# EAGLE schematic lpc1788_board (EAGLE 6.4)

## Sheet 1 of 4: LPC1788
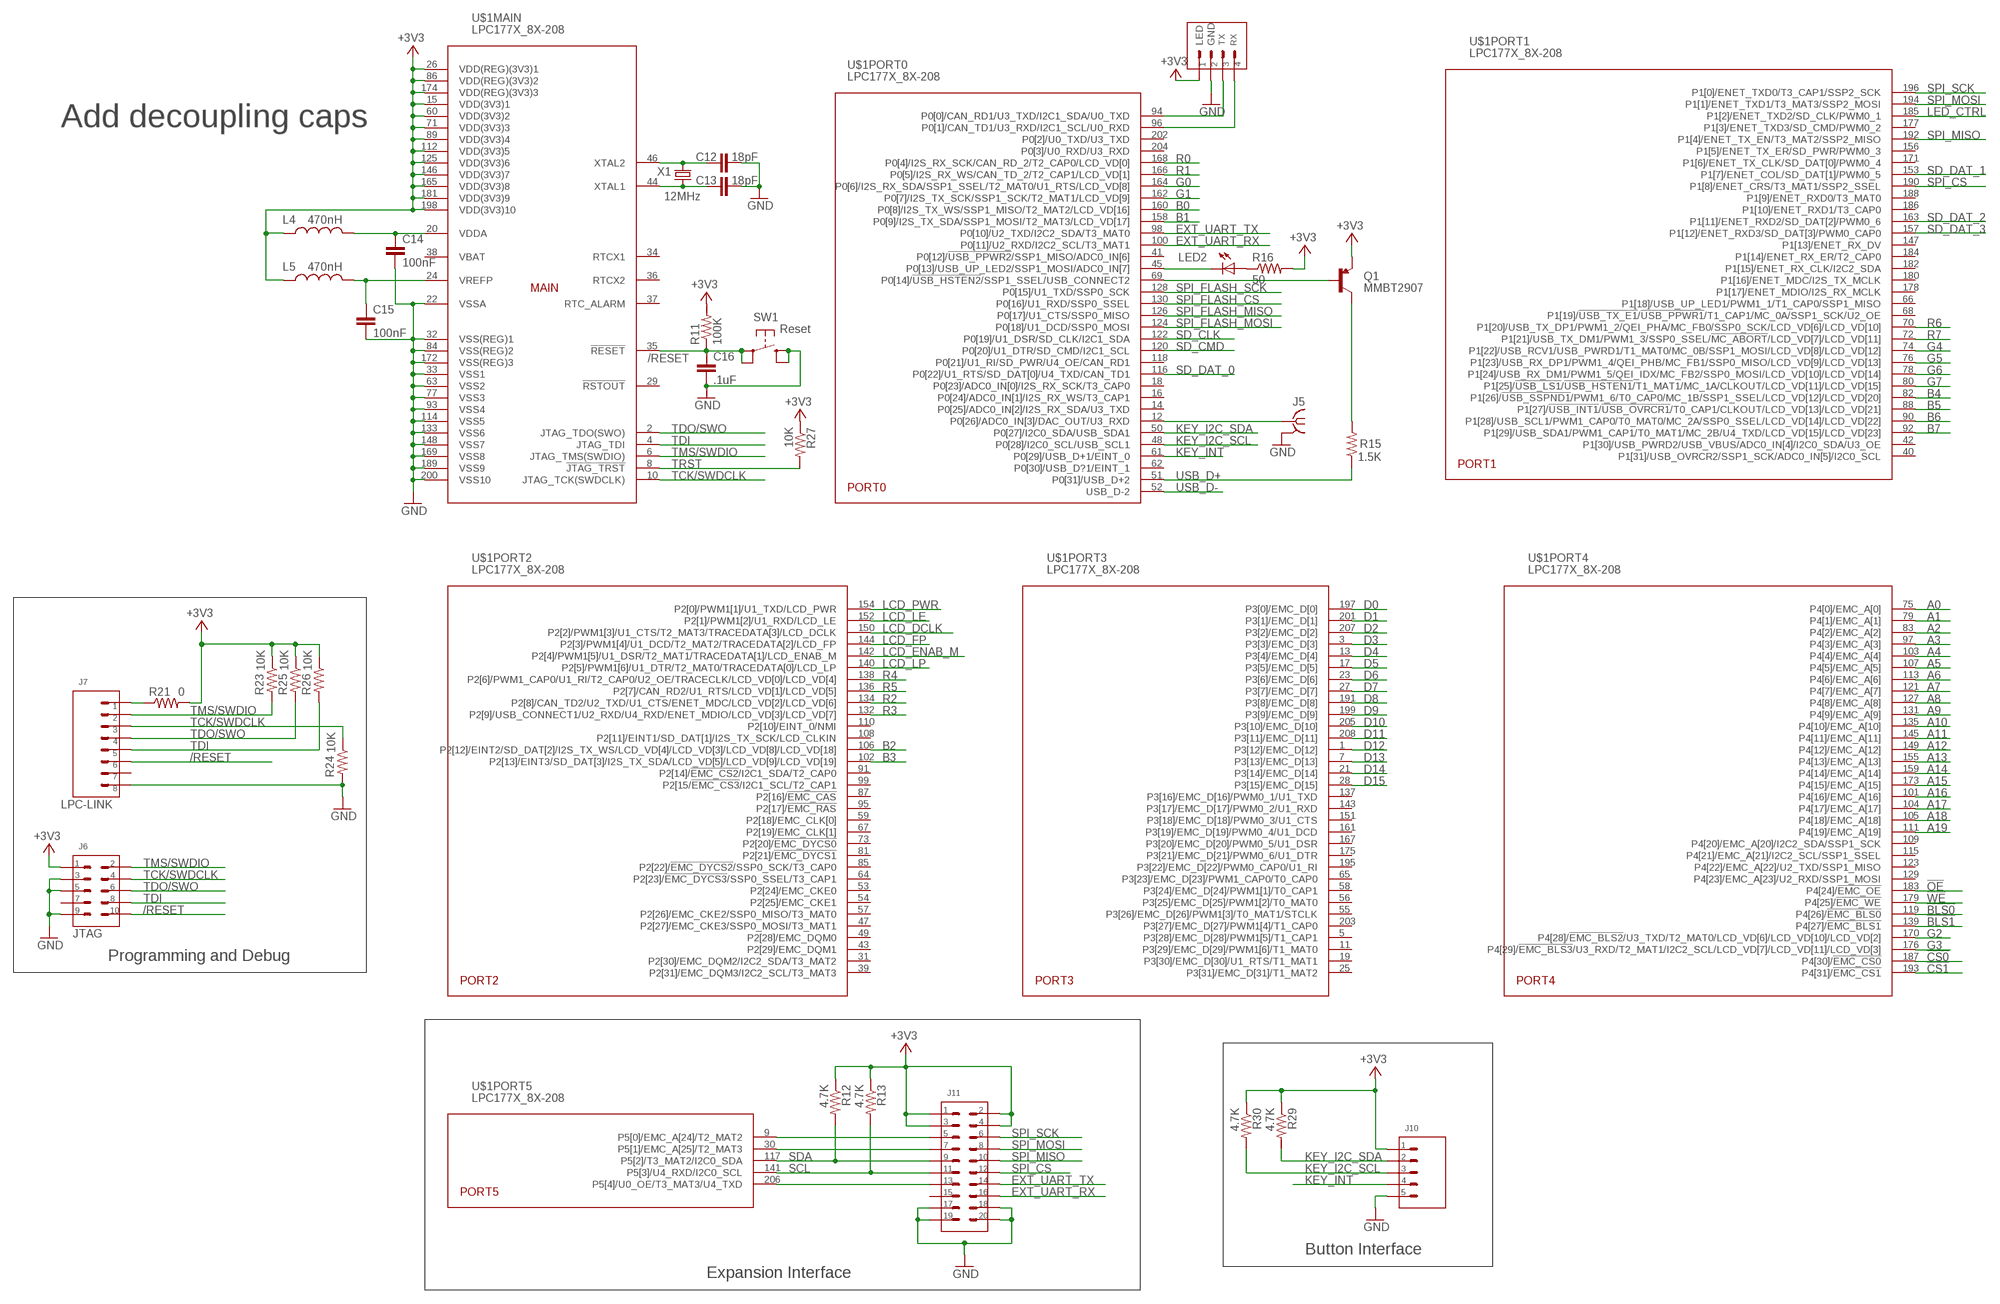
[diagram p0: schematic, sheet 1]

### Parts
C12  18pF  C-EUC0603  [C0603]
C13  18pF  C-EUC0603  [C0603]
C14  100nF  C-EUC0402  [C0402]
C15  100nF  C-EUC0402  [C0402]
C16  .1uF  C-EUC0603  [C0603]
J4  Console  FLEX_SERIAL_HEADER  [4-PIN_1.25MM]
J5  SMA-J-P-X-ST-EM1  [SMA-J-P-X-ST-EM1]
J6  JTAG  10PIN_5X2_.050IN  [10-PIN_5X2_.050IN_SMT]
J7  JTAG  8PIN_SIP_.100IN  [8-PIN_SIP_.100IN]
J10  MOLEX_527930570_5PIN_FFC_CONNECTOR  [MOLEX_527930570]
J11  20PIN_10X2_.100IN  [20-PIN_10X2_.100IN]
L4  470nH  INDUCTOR_0603  [0603]
L5  470nH  INDUCTOR_0603  [0603]
LED2  CHG  LEDCHIPLED_0603  [CHIPLED_0603]
Q1  MMBT2907  TRANSISTOR_PNPMMBT4403  [SOT23]
R11  100K  R-US_R0603  [R0603]
R12  4.7K  R-US_R0603  [R0603]
R13  4.7K  R-US_R0603  [R0603]
R15  1.5K  R-US_R0603  [R0603]
R16  50  R-US_R0402  [R0402]
R21  0  R-US_R0603  [R0603]
R23  10K  R-US_R0603  [R0603]
R24  10K  R-US_R0603  [R0603]
R25  10K  R-US_R0603  [R0603]
R26  10K  R-US_R0603  [R0603]
R27  10K  R-US_R0603  [R0603]
R29  4.7K  R-US_R0603  [R0603]
R30  4.7K  R-US_R0603  [R0603]
SW1  Reset  SMT_PUSHBUTTON  [SMT_PUSHBUTTON]
U$1  LPC177X_8X-208  [LQFP208]
X1  12MHz  XTAL_2SMD_8MMX4.5MM12MHZ  [2-SMD_8MMX4.5MM]

### Nets
!BLS0: U$1.119(PORT4:P4[26]/!EMC_BLS0!) ; also sheet 4
!BLS1: U$1.139(PORT4:P4[27]/!EMC_BLS1!) ; also sheet 4
!CS0: U$1.187(PORT4:P4[30]/!EMC_CS0!) ; also sheet 4
!CS1: U$1.193(PORT4:P4[31]/!EMC_CS1!)
!OE: U$1.183(PORT4:P4[24]/!EMC_OE!) ; also sheet 4
!WE: U$1.179(PORT4:P4[25]/!EMC_WE!) ; also sheet 4
+3V3: J4.1(S1) J6.P$1(S1) J10.P$1(S1) J11.1(S1) J11.2(S2) J11.3(S3) J11.4(S4) L4.1 L5.1 Q1.2(E) R11.2 R12.1 R13.1 R16.2 R21.2 R23.1 R25.1 R26.1 R27.1 R29.1 R30.1 U$1.15(MAIN:VDD(3V3)1) U$1.26(MAIN:VDD(REG)(3V3)1) U$1.60(MAIN:VDD(3V3)2) U$1.71(MAIN:VDD(3V3)3) U$1.86(MAIN:VDD(REG)(3V3)2) U$1.89(MAIN:VDD(3V3)4) U$1.112(MAIN:VDD(3V3)5) U$1.125(MAIN:VDD(3V3)6) U$1.146(MAIN:VDD(3V3)7) U$1.165(MAIN:VDD(3V3)8) U$1.174(MAIN:VDD(REG)(3V3)3) U$1.181(MAIN:VDD(3V3)9) U$1.198(MAIN:VDD(3V3)10) ; also sheet 2,3,4
/RESET: C16.1 J6.P$10(S10) J7.6(S6) R11.1 SW1.P$1(P1) SW1.P$2(P) U$1.35(MAIN:!RESET!)
A0: U$1.75(PORT4:P4[0]/EMC_A[0]) ; also sheet 4
A1: U$1.79(PORT4:P4[1]/EMC_A[1]) ; also sheet 4
A2: U$1.83(PORT4:P4[2]/EMC_A[2]) ; also sheet 4
A3: U$1.97(PORT4:P4[3]/EMC_A[3]) ; also sheet 4
A4: U$1.103(PORT4:P4[4]/EMC_A[4]) ; also sheet 4
A5: U$1.107(PORT4:P4[5]/EMC_A[5]) ; also sheet 4
A6: U$1.113(PORT4:P4[6]/EMC_A[6]) ; also sheet 4
A7: U$1.121(PORT4:P4[7]/EMC_A[7]) ; also sheet 4
A8: U$1.127(PORT4:P4[8]/EMC_A[8]) ; also sheet 4
A9: U$1.131(PORT4:P4[9]/EMC_A[9]) ; also sheet 4
A10: U$1.135(PORT4:P4[10]/EMC_A[10]) ; also sheet 4
A11: U$1.145(PORT4:P4[11]/EMC_A[11]) ; also sheet 4
A12: U$1.149(PORT4:P4[12]/EMC_A[12]) ; also sheet 4
A13: U$1.155(PORT4:P4[13]/EMC_A[13]) ; also sheet 4
A14: U$1.159(PORT4:P4[14]/EMC_A[14]) ; also sheet 4
A15: U$1.173(PORT4:P4[15]/EMC_A[15]) ; also sheet 4
A16: U$1.101(PORT4:P4[16]/EMC_A[16]) ; also sheet 4
A17: U$1.104(PORT4:P4[17]/EMC_A[17]) ; also sheet 4
A18: U$1.105(PORT4:P4[18]/EMC_A[18]) ; also sheet 4
A19: U$1.111(PORT4:P4[19]/EMC_A[19]) ; also sheet 4
B0: U$1.160(PORT0:P0[8]/I2S_TX_WS/SSP1_MISO/T2_MAT2/LCD_VD[16]) ; also sheet 3
B1: U$1.158(PORT0:P0[9]/I2S_TX_SDA/SSP1_MOSI/T2_MAT3/LCD_VD[17]) ; also sheet 3
B2: U$1.106(PORT2:P2[12]/EINT2/SD_DAT[2]/I2S_TX_WS/LCD_VD[4]/LCD_VD[3]/LCD_VD[8]/LCD_VD[18]) ; also sheet 3
B3: U$1.102(PORT2:P2[13]/EINT3/SD_DAT[3]/I2S_TX_SDA/LCD_VD[5]/LCD_VD[9]/LCD_VD[19]) ; also sheet 3
B4: U$1.82(PORT1:P1[26]/!USB_SSPND1!/PWM1_6/T0_CAP0/MC_1B/SSP1_SSEL/LCD_VD[12]/LCD_VD[20]) ; also sheet 3
B5: U$1.88(PORT1:P1[27]/!USB_INT1!/!USB_OVRCR1!/T0_CAP1/CLKOUT/LCD_VD[13]/LCD_VD[21]) ; also sheet 3
B6: U$1.90(PORT1:P1[28]/USB_SCL1/PWM1_CAP0/T0_MAT0/MC_2A/SSP0_SSEL/LCD_VD[14]/LCD_VD[22]) ; also sheet 3
B7: U$1.92(PORT1:P1[29]/USB_SDA1/PWM1_CAP1/T0_MAT1/MC_2B/U4_TXD/LCD_VD[15]/LCD_VD[23]) ; also sheet 3
D0: U$1.197(PORT3:P3[0]/EMC_D[0]) ; also sheet 4
D1: U$1.201(PORT3:P3[1]/EMC_D[1]) ; also sheet 4
D2: U$1.207(PORT3:P3[2]/EMC_D[2]) ; also sheet 4
D3: U$1.3(PORT3:P3[3]/EMC_D[3]) ; also sheet 4
D4: U$1.13(PORT3:P3[4]/EMC_D[4]) ; also sheet 4
D5: U$1.17(PORT3:P3[5]/EMC_D[5]) ; also sheet 4
D6: U$1.23(PORT3:P3[6]/EMC_D[6]) ; also sheet 4
D7: U$1.27(PORT3:P3[7]/EMC_D[7]) ; also sheet 4
D8: U$1.191(PORT3:P3[8]/EMC_D[8]) ; also sheet 4
D9: U$1.199(PORT3:P3[9]/EMC_D[9]) ; also sheet 4
D10: U$1.205(PORT3:P3[10]/EMC_D[10]) ; also sheet 4
D11: U$1.208(PORT3:P3[11]/EMC_D[11]) ; also sheet 4
D12: U$1.1(PORT3:P3[12]/EMC_D[12]) ; also sheet 4
D13: U$1.7(PORT3:P3[13]/EMC_D[13]) ; also sheet 4
D14: U$1.21(PORT3:P3[14]/EMC_D[14]) ; also sheet 4
D15: U$1.28(PORT3:P3[15]/EMC_D[15]) ; also sheet 4
EXT_UART_RX: J11.16(S16) U$1.100(PORT0:P0[11]/U2_RXD/I2C2_SCL/T3_MAT1)
EXT_UART_TX: J11.14(S14) U$1.98(PORT0:P0[10]/U2_TXD/I2C2_SDA/T3_MAT0)
G0: U$1.164(PORT0:P0[6]/I2S_RX_SDA/SSP1_SSEL/T2_MAT0/U1_RTS/LCD_VD[8]) ; also sheet 3
G1: U$1.162(PORT0:P0[7]/I2S_TX_SCK/SSP1_SCK/T2_MAT1/LCD_VD[9]) ; also sheet 3
G2: U$1.170(PORT4:P4[28]/!EMC_BLS2!/U3_TXD/T2_MAT0/LCD_VD[6]/LCD_VD[10]/LCD_VD[2]) ; also sheet 3
G3: U$1.176(PORT4:P4[29]/!EMC_BLS3!/U3_RXD/T2_MAT1/I2C2_SCL/LCD_VD[7]/LCD_VD[11]/LCD_VD[3]) ; also sheet 3
G4: U$1.74(PORT1:P1[22]/USB_RCV1/USB_PWRD1/T1_MAT0/MC_0B/SSP1_MOSI/LCD_VD[8]/LCD_VD[12]) ; also sheet 3
G5: U$1.76(PORT1:P1[23]/USB_RX_DP1/PWM1_4/QEI_PHB/MC_FB1/SSP0_MISO/LCD_VD[9]/LCD_VD[13]) ; also sheet 3
G6: U$1.78(PORT1:P1[24]/USB_RX_DM1/PWM1_5/QEI_IDX/MC_FB2/SSP0_MOSI/LCD_VD[10]/LCD_VD[14]) ; also sheet 3
G7: U$1.80(PORT1:P1[25]/!USB_LS1!/!USB_HSTEN1!/T1_MAT1/MC_1A/CLKOUT/LCD_VD[11]/LCD_VD[15]) ; also sheet 3
GND: C12.2 C13.2 C14.2 C15.2 C16.2 J4.2(S2) J5.G@1(GND) J6.P$3(S3) J6.P$5(S5) J6.P$9(S9) J7.8(S8) J10.P$5(S5) J11.17(S17) J11.18(S18) J11.19(S19) J11.20(S20) R24.2 SW1.P$3(S1) SW1.P$4(S) U$1.22(MAIN:VSSA) U$1.32(MAIN:VSS(REG)1) U$1.33(MAIN:VSS1) U$1.63(MAIN:VSS2) U$1.77(MAIN:VSS3) U$1.84(MAIN:VSS(REG)2) U$1.93(MAIN:VSS4) U$1.114(MAIN:VSS5) U$1.133(MAIN:VSS6) U$1.148(MAIN:VSS7) U$1.169(MAIN:VSS8) U$1.172(MAIN:VSS(REG)3) U$1.189(MAIN:VSS9) U$1.200(MAIN:VSS10) ; also sheet 2,3,4
KEY_I2C_SCL: J10.P$3(S3) R30.2 U$1.48(PORT0:P0[28]/I2C0_SCL/USB_SCL1)
KEY_I2C_SDA: J10.P$2(S2) R29.2 U$1.50(PORT0:P0[27]/I2C0_SDA/USB_SDA1)
KEY_INT: J10.P$4(S4) U$1.61(PORT0:P0[29]/USB_D+1/EINT_0)
LCD_DCLK: U$1.150(PORT2:P2[2]/PWM1[3]/U1_CTS/T2_MAT3/TRACEDATA[3]/LCD_DCLK) ; also sheet 3
LCD_ENAB_M: U$1.142(PORT2:P2[4]/PWM1[5]/U1_DSR/T2_MAT1/TRACEDATA[1]/LCD_ENAB_M) ; also sheet 3
LCD_FP: U$1.144(PORT2:P2[3]/PWM1[4]/U1_DCD/T2_MAT2/TRACEDATA[2]/LCD_FP) ; also sheet 3
LCD_LE: U$1.152(PORT2:P2[1]/PWM1[2]/U1_RXD/LCD_LE) ; also sheet 3
LCD_LP: U$1.140(PORT2:P2[5]/PWM1[6]/U1_DTR/T2_MAT0/TRACEDATA[0]/LCD_LP) ; also sheet 3
LCD_PWR: U$1.154(PORT2:P2[0]/PWM1[1]/U1_TXD/LCD_PWR) ; also sheet 3
LED_CTRL: U$1.185(PORT1:P1[2]/ENET_TXD2/SD_CLK/PWM0_1) ; also sheet 2
N$15: C12.1 U$1.46(MAIN:XTAL2) X1.2
N$16: C13.1 U$1.44(MAIN:XTAL1) X1.1
N$17: C14.1 L4.2 U$1.20(MAIN:VDDA)
N$18: C15.1 L5.2 U$1.24(MAIN:VREFP)
N$21: Q1.3(C) R15.2
N$22: Q1.1(B) U$1.69(PORT0:P0[14]/!USB_HSTEN2!/SSP1_SSEL/USB_CONNECT2)
N$23: LED2.A R16.1
N$24: LED2.C U$1.45(PORT0:P0[13]/USB_UP_LED2/SSP1_MOSI/ADC0_IN[7])
N$25: J4.3(S3) U$1.94(PORT0:P0[0]/CAN_RD1/U3_TXD/I2C1_SDA/U0_TXD)
N$26: J4.4(S4) U$1.96(PORT0:P0[1]/CAN_TD1/U3_RXD/I2C1_SCL/U0_RXD)
N$27: J5.1 U$1.12(PORT0:P0[26]/ADC0_IN[3]/DAC_OUT/U3_RXD)
N$30: J11.13(S13) U$1.206(PORT5:P5[4]/U0_OE/T3_MAT3/U4_TXD)
N$32: J11.7(S7) U$1.30(PORT5:P5[1]/EMC_A[25]/T2_MAT3)
N$34: J11.5(S5) U$1.9(PORT5:P5[0]/EMC_A[24]/T2_MAT2)
N$36: J7.1(S1) R21.1
R0: U$1.168(PORT0:P0[4]/I2S_RX_SCK/CAN_RD_2/T2_CAP0/LCD_VD[0]) ; also sheet 3
R1: U$1.166(PORT0:P0[5]/I2S_RX_WS/CAN_TD_2/T2_CAP1/LCD_VD[1]) ; also sheet 3
R2: U$1.134(PORT2:P2[8]/CAN_TD2/U2_TXD/U1_CTS/ENET_MDC/LCD_VD[2]/LCD_VD[6]) ; also sheet 3
R3: U$1.132(PORT2:P2[9]/USB_CONNECT1/U2_RXD/U4_RXD/ENET_MDIO/LCD_VD[3]/LCD_VD[7]) ; also sheet 3
R4: U$1.138(PORT2:P2[6]/PWM1_CAP0/U1_RI/T2_CAP0/U2_OE/TRACECLK/LCD_VD[0]/LCD_VD[4]) ; also sheet 3
R5: U$1.136(PORT2:P2[7]/CAN_RD2/U1_RTS/LCD_VD[1]/LCD_VD[5]) ; also sheet 3
R6: U$1.70(PORT1:P1[20]/USB_TX_DP1/PWM1_2/QEI_PHA/MC_FB0/SSP0_SCK/LCD_VD[6]/LCD_VD[10]) ; also sheet 3
R7: U$1.72(PORT1:P1[21]/USB_TX_DM1/PWM1_3/SSP0_SSEL/!MC_ABORT!/LCD_VD[7]/LCD_VD[11]) ; also sheet 3
SCL: J11.11(S11) R13.2 U$1.141(PORT5:P5[3]/U4_RXD/I2C0_SCL)
SD_CLK: U$1.122(PORT0:P0[19]/U1_DSR/SD_CLK/I2C1_SDA) ; also sheet 4
SD_CMD: U$1.120(PORT0:P0[20]/U1_DTR/SD_CMD/I2C1_SCL) ; also sheet 4
SD_DAT_0: U$1.116(PORT0:P0[22]/U1_RTS/SD_DAT[0]/U4_TXD/CAN_TD1) ; also sheet 4
SD_DAT_1: U$1.153(PORT1:P1[7]/ENET_COL/SD_DAT[1]/PWM0_5) ; also sheet 4
SD_DAT_2: U$1.163(PORT1:P1[11]/ENET_RXD2/SD_DAT[2]/PWM0_6) ; also sheet 4
SD_DAT_3: U$1.157(PORT1:P1[12]/ENET_RXD3/SD_DAT[3]/PWM0_CAP0) ; also sheet 4
SDA: J11.9(S9) R12.2 U$1.117(PORT5:P5[2]/T3_MAT2/I2C0_SDA)
SPI_CS: J11.12(S12) U$1.190(PORT1:P1[8]/ENET_CRS/T3_MAT1/SSP2_SSEL)
SPI_FLASH_CS: U$1.130(PORT0:P0[16]/U1_RXD/SSP0_SSEL) ; also sheet 4
SPI_FLASH_MISO: U$1.126(PORT0:P0[17]/U1_CTS/SSP0_MISO) ; also sheet 4
SPI_FLASH_MOSI: U$1.124(PORT0:P0[18]/U1_DCD/SSP0_MOSI) ; also sheet 4
SPI_FLASH_SCK: U$1.128(PORT0:P0[15]/U1_TXD/SSP0_SCK) ; also sheet 4
SPI_MISO: J11.10(S10) U$1.192(PORT1:P1[4]/ENET_TX_EN/T3_MAT2/SSP2_MISO)
SPI_MOSI: J11.8(S8) U$1.194(PORT1:P1[1]/ENET_TXD1/T3_MAT3/SSP2_MOSI)
SPI_SCK: J11.6(S6) U$1.196(PORT1:P1[0]/ENET_TXD0/T3_CAP1/SSP2_SCK)
TCK/SWDCLK: J6.P$4(S4) J7.3(S3) R24.1 U$1.10(MAIN:JTAG_TCK(SWDCLK))
TDI: J6.P$8(S8) J7.5(S5) R26.2 U$1.4(MAIN:JTAG_TDI)
TDO/SWO: J6.P$6(S6) J7.4(S4) R25.2 U$1.2(MAIN:JTAG_TDO(SWO))
TMS/SWDIO: J6.P$2(S2) J7.2(S2) R23.2 U$1.6(MAIN:JTAG_TMS(SWDIO))
TRST: R27.2 U$1.8(MAIN:!JTAG_TRST!)
USB_D+: R15.1 U$1.51(PORT0:P0[31]/USB_D+2) ; also sheet 2
USB_D-: U$1.52(PORT0:USB_D-2) ; also sheet 2
Unconnected: J6.P$7(S7) J7.7(S7) J11.15(S15) U$1.5(PORT3:P3[28]/EMC_D[28]/PWM1[5]/T1_CAP1) U$1.11(PORT3:P3[29]/EMC_D[29]/PWM1[6]/T1_MAT0) U$1.14(PORT0:P0[25]/ADC0_IN[2]/I2S_RX_SDA/U3_TXD) U$1.16(PORT0:P0[24]/ADC0_IN[1]/I2S_RX_WS/T3_CAP1) U$1.18(PORT0:P0[23]/ADC0_IN[0]/I2S_RX_SCK/T3_CAP0) U$1.19(PORT3:P3[30]/EMC_D[30]/U1_RTS/T1_MAT1) U$1.25(PORT3:P3[31]/EMC_D[31]/T1_MAT2) U$1.29(MAIN:!RSTOUT!) U$1.31(PORT2:P2[30]/EMC_DQM2/I2C2_SDA/T3_MAT2) U$1.34(MAIN:RTCX1) U$1.36(MAIN:RTCX2) U$1.37(MAIN:RTC_ALARM) U$1.38(MAIN:VBAT) U$1.39(PORT2:P2[31]/EMC_DQM3/I2C2_SCL/T3_MAT3) U$1.40(PORT1:P1[31]/USB_OVRCR2/SSP1_SCK/ADC0_IN[5]/I2C0_SCL) U$1.41(PORT0:P0[12]/!USB_PPWR2!/SSP1_MISO/ADC0_IN[6]) U$1.42(PORT1:P1[30]/USB_PWRD2/USB_VBUS/ADC0_IN[4]/I2C0_SDA/U3_OE) U$1.43(PORT2:P2[29]/EMC_DQM1) U$1.47(PORT2:P2[27]/EMC_CKE3/SSP0_MOSI/T3_MAT1) U$1.49(PORT2:P2[28]/EMC_DQM0) U$1.53(PORT2:P2[24]/EMC_CKE0) U$1.54(PORT2:P2[25]/EMC_CKE1) U$1.55(PORT3:P3[26]/EMC_D[26]/PWM1[3]/T0_MAT1/STCLK) U$1.56(PORT3:P3[25]/EMC_D[25]/PWM1[2]/T0_MAT0) U$1.57(PORT2:P2[26]/EMC_CKE2/SSP0_MISO/T3_MAT0) U$1.58(PORT3:P3[24]/EMC_D[24]/PWM1[1]/T0_CAP1) U$1.59(PORT2:P2[18]/EMC_CLK[0]) U$1.62(PORT0:P0[30]/USB_D?1/EINT_1) U$1.64(PORT2:P2[23]/!EMC_DYCS3!/SSP0_SSEL/T3_CAP1) U$1.65(PORT3:P3[23]/EMC_D[23]/PWM1_CAP0/T0_CAP0) U$1.66(PORT1:P1[18]/USB_UP_LED1/PWM1_1/T1_CAP0/SSP1_MISO) U$1.67(PORT2:P2[19]/EMC_CLK[1]) U$1.68(PORT1:P1[19]/!USB_TX_E1!/!USB_PPWR1!/T1_CAP1/MC_0A/SSP1_SCK/U2_OE) U$1.73(PORT2:P2[20]/!EMC_DYCS0!) U$1.81(PORT2:P2[21]/!EMC_DYCS1!) U$1.85(PORT2:P2[22]/!EMC_DYCS2!/SSP0_SCK/T3_CAP0) U$1.87(PORT2:P2[16]/!EMC_CAS!) U$1.91(PORT2:P2[14]/!EMC_CS2!/I2C1_SDA/T2_CAP0) U$1.95(PORT2:P2[17]/!EMC_RAS!) U$1.99(PORT2:P2[15/!EMC_CS3!/I2C1_SCL/T2_CAP1) U$1.108(PORT2:P2[11]/EINT1/SD_DAT[1]/I2S_TX_SCK/LCD_CLKIN) U$1.109(PORT4:P4[20]/EMC_A[20]/I2C2_SDA/SSP1_SCK) U$1.110(PORT2:P2[10]/EINT_0/NMI) U$1.115(PORT4:P4[21]/EMC_A[21]/I2C2_SCL/SSP1_SSEL) U$1.118(PORT0:P0[21]/U1_RI/SD_PWR/U4_OE/CAN_RD1) U$1.123(PORT4:P4[22]/EMC_A[22]/U2_TXD/SSP1_MISO) U$1.129(PORT4:P4[23]/EMC_A[23]/U2_RXD/SSP1_MOSI) U$1.137(PORT3:P3[16]/EMC_D[16]/PWM0_1/U1_TXD) U$1.143(PORT3:P3[17]/EMC_D[17]/PWM0_2/U1_RXD) U$1.147(PORT1:P1[13]/ENET_RX_DV) U$1.151(PORT3:P3[18]/EMC_D[18]/PWM0_3/U1_CTS) U$1.156(PORT1:P1[5]/ENET_TX_ER/SD_PWR/PWM0_3) U$1.161(PORT3:P3[19]/EMC_D[19]/PWM0_4/U1_DCD) U$1.167(PORT3:P3[20]/EMC_D[20]/PWM0_5/U1_DSR) U$1.171(PORT1:P1[6]/ENET_TX_CLK/SD_DAT[0]/PWM0_4) U$1.175(PORT3:P3[21]/EMC_D[21]/PWM0_6/U1_DTR) U$1.177(PORT1:P1[3]/ENET_TXD3/SD_CMD/PWM0_2) U$1.178(PORT1:P1[17]/ENET_MDIO/I2S_RX_MCLK) U$1.180(PORT1:P1[16]/ENET_MDC/I2S_TX_MCLK) U$1.182(PORT1:P1[15]/ENET_RX_CLK/I2C2_SDA) U$1.184(PORT1:P1[14]/ENET_RX_ER/T2_CAP0) U$1.186(PORT1:P1[10]/ENET_RXD1/T3_CAP0) U$1.188(PORT1:P1[9]/ENET_RXD0/T3_MAT0) U$1.195(PORT3:P3[22]/EMC_D[22]/PWM0_CAP0/U1_RI) U$1.202(PORT0:P0[2]/U0_TXD/U3_TXD) U$1.203(PORT3:P3[27]/EMC_D[27]/PWM1[4]/T1_CAP0) U$1.204(PORT0:P0[3]/U0_RXD/U3_RXD)

### Notes on the sheet
- Add decoupling caps
- LPC-LINK
- JTAG
- Programming and Debug
- Button Interface
- Expansion Interface

## Sheet 2 of 4: Power
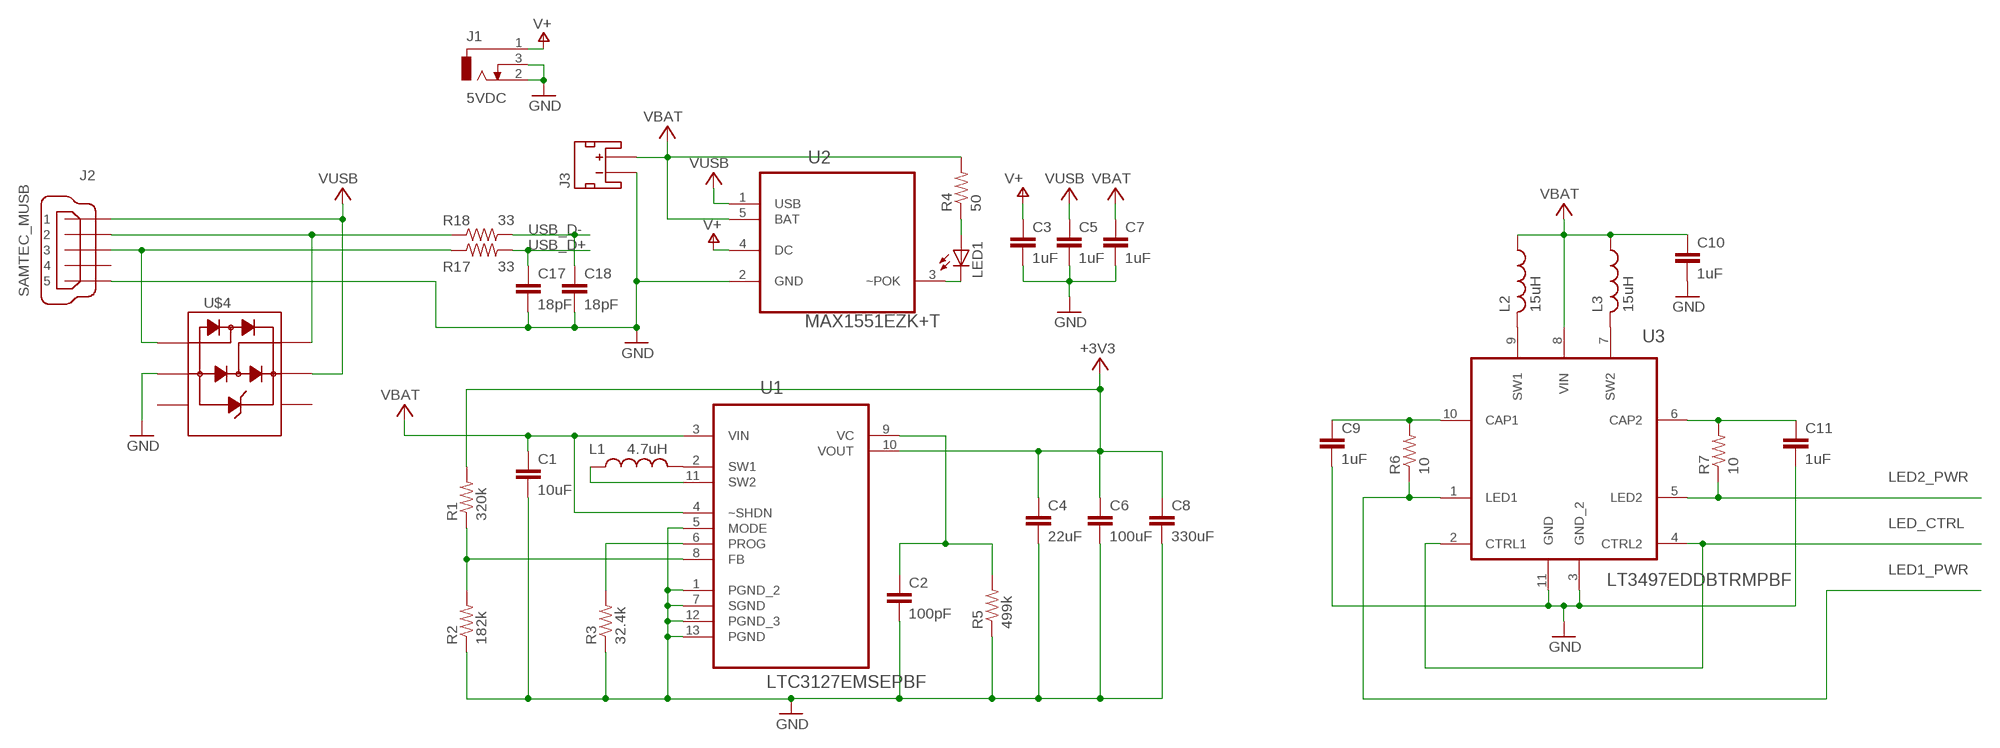
[diagram p1: schematic, sheet 2]

### Parts
C1  10uF  C-EUC0402  [C0402]
C2  100pF  C-EUC0402  [C0402]
C3  1uF  C-EUC0402  [C0402]
C4  22uF  C-EUC0805  [C0805]
C5  1uF  C-EUC0402  [C0402]
C6  100uF  C-EUC1206  [C1206]
C7  1uF  C-EUC0402  [C0402]
C8  330uF  C-EUC1206  [C1206]
C9  1uF  C-EUC0805  [C0805]
C10  1uF  C-EUC0402  [C0402]
C11  1uF  C-EUC0805  [C0805]
C17  18pF  C-EUC0402  [C0402]
C18  18pF  C-EUC0402  [C0402]
J1  5VDC  DC_POWER_JACK_PJ-045  [PJ-045]
J2  SAMTEC_MUSB  [MUSB-05-X-B-SM-A]
J3  JST_2MM_SMT  [JST_2MM_SMT]
L1  4.7uH  INDUCTOR_NR6028  [NR6028]
L2  15uH  L-USL3225M  [L3225M]
L3  15uH  L-USL3225M  [L3225M]
LED1  CHG  LEDCHIPLED_0603  [CHIPLED_0603]
R1  320k  R-US_R0402  [R0402]
R2  182k  R-US_R0402  [R0402]
R3  32.4k  R-US_R0402  [R0402]
R4  50  R-US_R0402  [R0402]
R5  499k  R-US_R0402  [R0402]
R6  10  R-US_R0402  [R0402]
R7  10  R-US_R0402  [R0402]
R17  33  R-US_R0402  [R0402]
R18  33  R-US_R0402  [R0402]
U1  LTC3127EMSEPBF  [SOP65P490X110-13N]
U2  MAX1551EZK+T  [SOT95P275X110-5N]
U3  LT3497EDDBTRMPBF  [DFN300X200X80-11N]
U$4  NUP2202  [SC-88]

### Nets
+3V3: C4.1 C6.1 C8.1 R1.2 U1.10(VOUT) ; also sheet 1,3,4
+VBAT: C1.1 C7.1 C10.1 J3.2(+) L2.1 L3.1 R4.2 U1.3(VIN) U1.4(~SHDN) U2.5(BAT) U3.8(VIN) ; supply symbol labelled VBAT
+VUSB: C5.1 J2.1 U2.1(USB) U$4.P$5 ; supply symbol labelled VUSB
GND: C1.2 C2.2 C3.2 C4.2 C5.2 C6.2 C7.2 C8.2 C9.2 C10.2 C11.2 C17.2 C18.2 J1.2 J1.3 J2.5 J3.1(-) R2.1 R3.1 R5.1 U1.1(PGND_2) U1.5(MODE) U1.7(SGND) U1.12(PGND_3) U1.13(PGND) U2.2(GND) U3.3(GND_2) U3.11(GND) U$4.P$2 ; also sheet 1,3,4
LED1_PWR: R6.1 U3.1(LED1) ; also sheet 3
LED2_PWR: R7.1 U3.5(LED2) ; also sheet 3
LED_CTRL: U3.2(CTRL1) U3.4(CTRL2) ; also sheet 1
N$1: R3.2 U1.6(PROG)
N$2: R1.1 R2.2 U1.8(FB)
N$3: L1.2 U1.2(SW1)
N$4: L1.1 U1.11(SW2)
N$5: LED1.C U2.3(~POK)
N$6: C9.1 R6.2 U3.10(CAP1)
N$7: C2.1 R5.2 U1.9(VC)
N$8: LED1.A R4.1
N$11: C11.1 R7.2 U3.6(CAP2)
N$12: L2.2 U3.9(SW1)
N$13: L3.2 U3.7(SW2)
N$19: J2.2 R18.1 U$4.P$6
N$20: J2.3 R17.1 U$4.P$1
USB_D+: C17.1 R17.2 ; also sheet 1
USB_D-: C18.1 R18.2 ; also sheet 1
V+: C3.1 J1.1 U2.4(DC)
Unconnected: J2.4 U$4.P$3 U$4.P$4

## Sheet 3 of 4: LCD
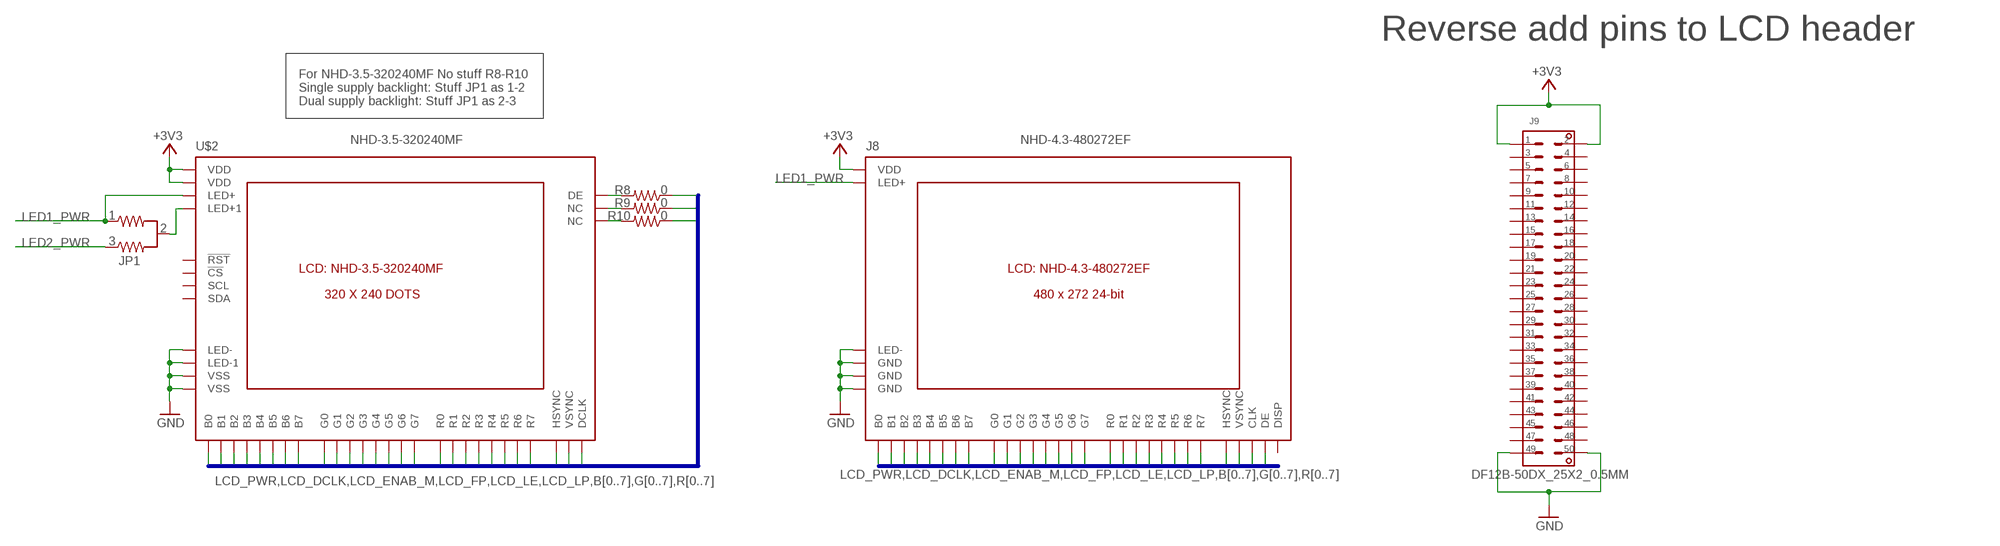
[diagram p2: schematic, sheet 3]

### Parts
J8  NHD-4.3-480272EF  [FCI_62684-402100ALF]
J9  DF12B-50DX_25X2_0.5MM  [DF12B-50DX_25X2_0.5MM]
JP1  RESISTOR_JUMPER_0402  [RESISTOR_JUMPER_0402]
R8  0  R-US_R0402  [R0402]
R9  0  R-US_R0402  [R0402]
R10  0  R-US_R0402  [R0402]
U$2  NHD-3.5-320240MF  [MOLEX_51296-5494]

### Nets
+3V3: J8.P$4(VDD) J9.P$1(S1) J9.P$2(S2) U$2.P$41(VDD) U$2.P$42(VDD) ; also sheet 1,2,4
B0: J8.P$21(B0) U$2.P$12(B0) ; also sheet 1
B1: J8.P$22(B1) U$2.P$13(B1) ; also sheet 1
B2: J8.P$23(B2) U$2.P$14(B2) ; also sheet 1
B3: J8.P$24(B3) U$2.P$15(B3) ; also sheet 1
B4: J8.P$25(B4) U$2.P$16(B4) ; also sheet 1
B5: J8.P$26(B5) U$2.P$17(B5) ; also sheet 1
B6: J8.P$27(B6) U$2.P$18(B6) ; also sheet 1
B7: J8.P$28(B7) U$2.P$19(B7) ; also sheet 1
G0: J8.P$13(G0) U$2.P$20(G0) ; also sheet 1
G1: J8.P$14(G1) U$2.P$21(G1) ; also sheet 1
G2: J8.P$15(G2) U$2.P$22(G2) ; also sheet 1
G3: J8.P$16(G3) U$2.P$23(G3) ; also sheet 1
G4: J8.P$17(G4) U$2.P$24(G4) ; also sheet 1
G5: J8.P$18(G5) U$2.P$25(G5) ; also sheet 1
G6: J8.P$19(G6) U$2.P$26(G6) ; also sheet 1
G7: J8.P$20(G7) U$2.P$27(G7) ; also sheet 1
GND: J8.P$1(LED-) J8.P$3(GND) J8.P$29(GND) J8.P$36(GND) J9.P$49(S49) J9.P$50(S50) U$2.P$1(LED-) U$2.P$2(LED-1) U$2.P$53(VSS) U$2.P$54(VSS) ; also sheet 1,2,4
LCD_DCLK: J8.P$30(CLK) U$2.P$38(DCLK) ; also sheet 1
LCD_ENAB_M: J8.P$34(DE) R8.1 ; also sheet 1
LCD_FP: J8.P$33(VSYNC) U$2.P$37(VSYNC) ; also sheet 1
LCD_LE: R9.1 ; also sheet 1
LCD_LP: J8.P$32(HSYNC) U$2.P$36(HSYNC) ; also sheet 1
LCD_PWR: R10.1 ; also sheet 1
LED1_PWR: J8.P$2(LED+) JP1.1 U$2.P$3(LED+) ; also sheet 2
LED2_PWR: JP1.3 ; also sheet 2
LED+1: JP1.2 U$2.P$4(LED+1)
N$9: R8.2 U$2.P$52(DE)
N$10: R9.2 U$2.P$50(NC)
N$14: R10.2 U$2.P$51(NC)
R0: J8.P$5(R0) U$2.P$28(R0) ; also sheet 1
R1: J8.P$6(R1) U$2.P$29(R1) ; also sheet 1
R2: J8.P$7(R2) U$2.P$30(R2) ; also sheet 1
R3: J8.P$8(R3) U$2.P$31(R3) ; also sheet 1
R4: J8.P$9(R4) U$2.P$32(R4) ; also sheet 1
R5: J8.P$10(R5) U$2.P$33(R5) ; also sheet 1
R6: J8.P$11(R6) U$2.P$34(R6) ; also sheet 1
R7: J8.P$12(R7) U$2.P$35(R7) ; also sheet 1
Unconnected: J8.P$31(DISP) J9.P$3(S3) J9.P$4(S4) J9.P$5(S5) J9.P$6(S6) J9.P$7(S7) J9.P$8(S8) J9.P$9(S9) J9.P$10(S10) J9.P$11(S11) J9.P$12(S12) J9.P$13(S13) J9.P$14(S14) J9.P$15(S15) J9.P$16(S16) J9.P$17(S17) J9.P$18(S18) J9.P$19(S19) J9.P$20(S20) J9.P$21(S21) J9.P$22(S22) J9.P$23(S23) J9.P$24(S24) J9.P$25(S25) J9.P$26(S26) J9.P$27(S27) J9.P$28(S28) J9.P$29(S29) J9.P$30(S30) J9.P$31(S31) J9.P$32(S32) J9.P$33(S33) J9.P$34(S34) J9.P$35(S35) J9.P$36(S36) J9.P$37(S37) J9.P$38(S38) J9.P$39(S39) J9.P$40(S40) J9.P$41(S41) J9.P$42(S42) J9.P$43(S43) J9.P$44(S44) J9.P$45(S45) J9.P$46(S46) J9.P$47(S47) J9.P$48(S48) U$2.P$8(!RST) U$2.P$9(!CS) U$2.P$10(SCL) U$2.P$11(SDA)

### Buses
LCD_PWR,LCD_DCLK,LCD_ENAB_M,LCD_FP,LCD_LE,LCD_LP,B[0..7],G[0..7],R[0..7]

### Notes on the sheet
- Reverse add pins to LCD header
- For NHD-3.5-320240MF No stuff R8-R10
  Single supply backlight: Stuff JP1 as 1-2
  Dual supply backlight: Stuff JP1 as 2-3

## Sheet 4 of 4: Memory
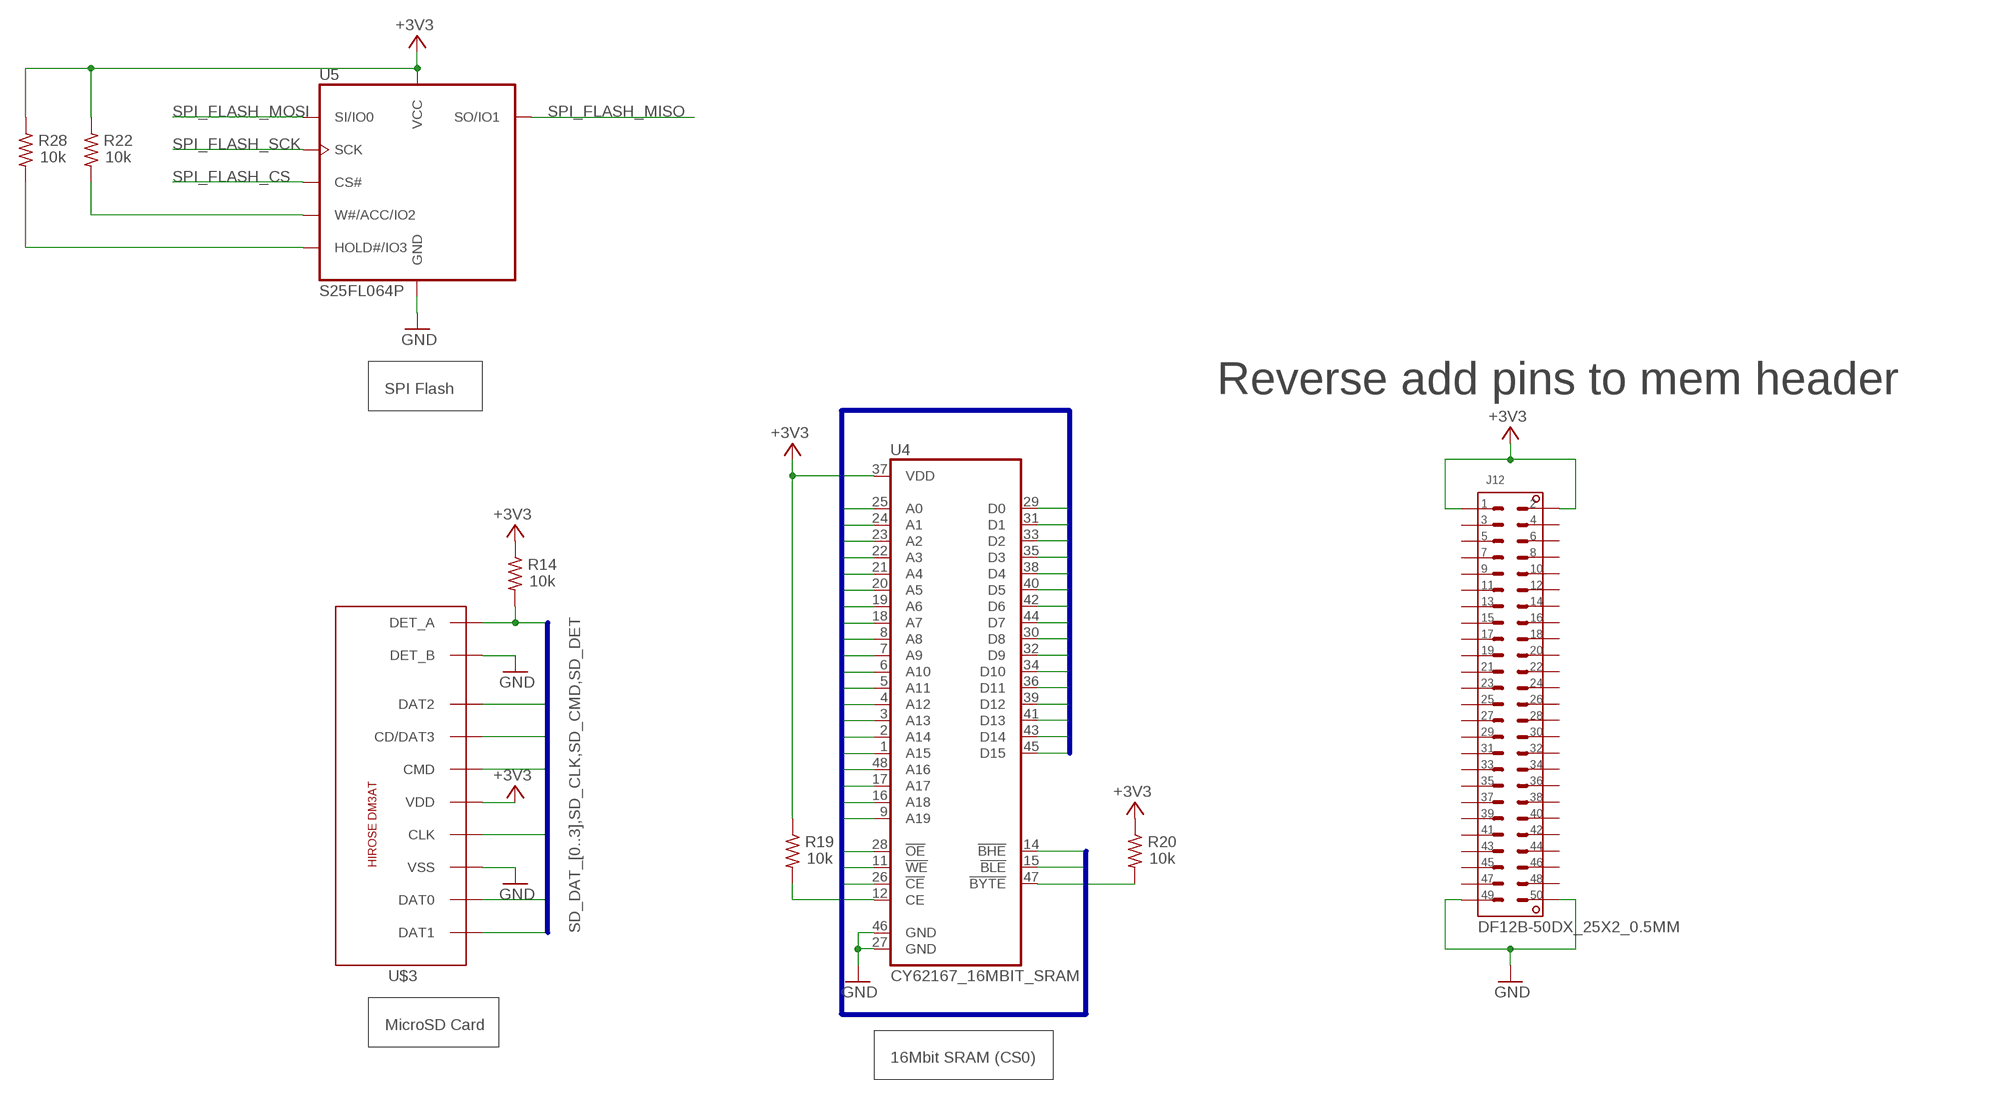
[diagram p3: schematic, sheet 4]

### Parts
J12  DF12B-50DX_25X2_0.5MM  [DF12B-50DX_25X2_0.5MM]
R14  10k  R-US_R0402  [R0402]
R19  10k  R-US_R0402  [R0402]
R20  10k  R-US_R0402  [R0402]
R22  10k  R-US_R0402  [R0402]
R28  10k  R-US_R0402  [R0402]
U4  CY62167_16MBIT_SRAM  [TSOP48]
U5  S25FL064P  [SO3_016]
U$3  DM3AT  [DM3AT]

### Nets
!BLS0: U4.15(!BLE) ; also sheet 1
!BLS1: U4.14(!BHE) ; also sheet 1
!CS0: U4.26(!CE) ; also sheet 1
!OE: U4.28(!OE) ; also sheet 1
!WE: U4.11(!WE) ; also sheet 1
+3V3: J12.P$1(S1) J12.P$2(S2) R14.1 R19.1 R20.1 R22.1 R28.1 U4.37(VDD) U5.P$2(VCC) U$3.VDD ; also sheet 1,2,3
A0: U4.25(A0) ; also sheet 1
A1: U4.24(A1) ; also sheet 1
A2: U4.23(A2) ; also sheet 1
A3: U4.22(A3) ; also sheet 1
A4: U4.21(A4) ; also sheet 1
A5: U4.20(A5) ; also sheet 1
A6: U4.19(A6) ; also sheet 1
A7: U4.18(A7) ; also sheet 1
A8: U4.8(A8) ; also sheet 1
A9: U4.7(A9) ; also sheet 1
A10: U4.6(A10) ; also sheet 1
A11: U4.5(A11) ; also sheet 1
A12: U4.4(A12) ; also sheet 1
A13: U4.3(A13) ; also sheet 1
A14: U4.2(A14) ; also sheet 1
A15: U4.1(A15) ; also sheet 1
A16: U4.48(A16) ; also sheet 1
A17: U4.17(A17) ; also sheet 1
A18: U4.16(A18) ; also sheet 1
A19: U4.9(A19) ; also sheet 1
D0: U4.29(D0) ; also sheet 1
D1: U4.31(D1) ; also sheet 1
D2: U4.33(D2) ; also sheet 1
D3: U4.35(D3) ; also sheet 1
D4: U4.38(D4) ; also sheet 1
D5: U4.40(D5) ; also sheet 1
D6: U4.42(D6) ; also sheet 1
D7: U4.44(D7) ; also sheet 1
D8: U4.30(D8) ; also sheet 1
D9: U4.32(D9) ; also sheet 1
D10: U4.34(D10) ; also sheet 1
D11: U4.36(D11) ; also sheet 1
D12: U4.39(D12) ; also sheet 1
D13: U4.41(D13) ; also sheet 1
D14: U4.43(D14) ; also sheet 1
D15: U4.45(D15) ; also sheet 1
GND: J12.P$49(S49) J12.P$50(S50) U4.27(GND) U4.46(GND) U5.P$10(GND) U$3.DET_B U$3.VSS ; also sheet 1,2,3
N$28: R19.2 U4.12(CE)
N$29: R20.2 U4.47(!BYTE)
N$31: R22.2 U5.P$9(W#/ACC/IO2)
N$33: R28.2 U5.P$1(HOLD#/IO3)
SD_CLK: U$3.CLK ; also sheet 1
SD_CMD: U$3.CMD ; also sheet 1
SD_DAT_0: U$3.DAT0 ; also sheet 1
SD_DAT_1: U$3.DAT1 ; also sheet 1
SD_DAT_2: U$3.DAT2 ; also sheet 1
SD_DAT_3: U$3.CD/DAT3 ; also sheet 1
SD_DET: R14.2 U$3.DET_A
SPI_FLASH_CS: U5.P$7(CS#) ; also sheet 1
SPI_FLASH_MISO: U5.P$8(SO/IO1) ; also sheet 1
SPI_FLASH_MOSI: U5.P$15(SI/IO0) ; also sheet 1
SPI_FLASH_SCK: U5.P$16(SCK) ; also sheet 1
Unconnected: J12.P$3(S3) J12.P$4(S4) J12.P$5(S5) J12.P$6(S6) J12.P$7(S7) J12.P$8(S8) J12.P$9(S9) J12.P$10(S10) J12.P$11(S11) J12.P$12(S12) J12.P$13(S13) J12.P$14(S14) J12.P$15(S15) J12.P$16(S16) J12.P$17(S17) J12.P$18(S18) J12.P$19(S19) J12.P$20(S20) J12.P$21(S21) J12.P$22(S22) J12.P$23(S23) J12.P$24(S24) J12.P$25(S25) J12.P$26(S26) J12.P$27(S27) J12.P$28(S28) J12.P$29(S29) J12.P$30(S30) J12.P$31(S31) J12.P$32(S32) J12.P$33(S33) J12.P$34(S34) J12.P$35(S35) J12.P$36(S36) J12.P$37(S37) J12.P$38(S38) J12.P$39(S39) J12.P$40(S40) J12.P$41(S41) J12.P$42(S42) J12.P$43(S43) J12.P$44(S44) J12.P$45(S45) J12.P$46(S46) J12.P$47(S47) J12.P$48(S48)

### Buses
SD_DAT_[0..3],SD_CLK,SD_CMD,SD_DET
A[0..19],D[0..15],!OE,!WE,!CS0,!BLS0,!BLS1

### Notes on the sheet
- SPI Flash | Reverse add pins to mem header
- MicroSD Card
- 16Mbit SRAM (CS0)

## Library data of the parts
C1-C18 = rcl:C-EU: CAPACITOR, European symbol
J1 = Custom:DC_POWER_JACK_PJ-045; DIGIKEY: CP-045-ND
J2 = Custom:SAMTEC_MUSB
J3 = Custom:JST_2MM_SMT; DIGIKEY: 455-1749-1-ND
J4 = Custom:FLEX_SERIAL_HEADER
J5 = Custom:SMA-J-P-X-ST-EM1
J6 = Custom:10PIN_5X2_.050IN
J7 = Custom:8PIN_SIP_.100IN
J8 = Custom:NHD-4.3-480272EF: Newhaven TFT LCD display NHD-4.3-480272EF 4.3" 480x272 24-bit RGB
J9 J12 = Custom:DF12B-50DX_25X2_0.5MM: DF12B-50Dx 25 x 2 pin 0.5mm Stacking Header Supports both DF12B(5.0)-50DP-0.5V and DF12B-50DS-0.5V
J10 = Custom:MOLEX_527930570_5PIN_FFC_CONNECTOR: Molex 527930570 5 pin 1mm pitch FFC connector
J11 = Custom:20PIN_10X2_.100IN: 20 Pin 10x2 .1 in header
JP1 = Custom:RESISTOR_JUMPER_0402
L1 = Custom:INDUCTOR_NR6028
L2 L3 = rcl:L-US: INDUCTOR, American symbol
L4 L5 = Custom:INDUCTOR_0603
LED1 LED2 = led:LED: LED OSRAM: - CHIPLED LG R971, LG N971, LY N971, LG Q971, LY Q971, LO R971, LY R971 LH N974, LH R974 LS Q976, LO Q976, LY Q976 LO Q996 - Hyper CHIPLED LW Q18S LB Q993, LB Q99A, LB R99A - SideLED LS A670, LO A670, LY A670, LG A670, LP A670 LB A673, LV A673, LT A673, LW A673 LH A674 LY A675 LS A676, LA A676, LO A676, LY A676, LW A676 LS A679, LY A679, LG A679 - Hyper Micro SIDELED® LS Y876, LA Y876, LO Y876, LY Y876 LT Y87S - SmartLED LW L88C, LW L88S LB L89C, LB L89S, LG L890 LS L89K, LO L89K, LY L89K LS L896, LA L896, LO L896, LY L896 - TOPLED LS T670, LO T670, LY T670, LG T670, LP T670 LSG T670, LSP T670, LSY T670, LOP T670, LYG T670 LG T671, LOG T671, LSG T671 LB T673, LV T673, LT T673, LW T673 LH T674 LS T676, LA T676, LO T676, LY T676, LB T676, LH T676, LSB T676, LW T676 LB T67C, LV T67C, LT T67C, LS T67K, LO T67K, LY T67K, LW E67C LS E67B, LA E67B, LO E67B, LY E67B, LB E67C, LV E67C, LT E67C LW T67C LS T679, LY T679, LG T679 LS T770, LO T770, LY T770, LG T770, LP T770 LB T773, LV T773, LT T773, LW T773 LH T774 LS E675, LA E675, LY E675, LS T675 LS T776, LA T776, LO T776, LY T776, LB T776 LHGB T686 LT T68C, LB T68C - Hyper Mini TOPLED® LB M676 - Mini TOPLED Santana® LG M470 LS M47K, LO M47K, LY M47K Source: http://www.osram.convergy.de LUXEON: - LUMILED® LXK2-PW12-R00, LXK2-PW12-S00, LXK2-PW14-U00, LXK2-PW14-V00 LXK2-PM12-R00, LXK2-PM12-S00, LXK2-PM14-U00 LXK2-PE12-Q00, LXK2-PE12-R00, LXK2-PE12-S00, LXK2-PE14-T00, LXK2-PE14-U00 LXK2-PB12-K00, LXK2-PB12-L00, LXK2-PB12-M00, LXK2-PB14-N00, LXK2-PB14-P00, LXK2-PB14-Q00 LXK2-PR12-L00, LXK2-PR12-M00, LXK2-PR14-Q00, LXK2-PR14-R00 LXK2-PD12-Q00, LXK2-PD12-R00, LXK2-PD12-S00 LXK2-PH12-R00, LXK2-PH12-S00 LXK2-PL12-P00, LXK2-PL12-Q00, LXK2-PL12-R00 Source: www.luxeon.com KINGBRIGHT: KA-3528ASYC Source: www.kingbright.com
Q1 = SparkFun-DiscreteSemi:TRANSISTOR_PNP: Generic PNP BJT Double check pinouts against datasheets- not all devices are the same! MMBT3906 - 40V 200mA SOT-23 (TRANS-08052) MMBT4403 - 40V 600mA SOT-23 (TRANS-09245); PROD_ID: TRANS-09245; VALUE: MMBT4403
R1-R30 = rcl:R-US_: RESISTOR, American symbol
SW1 = Custom:SMT_PUSHBUTTON: SMT Pushbutton 5.2 x 5.2 mm
U1 = LTC:LTC3127EMSEPBF: 1A Buck-Boost DC/DC Converter with Programmable Input Current Limit; MANUFACTURER: LTC3127EMSE#PBF; OC_FARNELL: 1801165; OC_NEWARK: 67R4282; PACKAGE: MSOP-12; SUPPLIER: Linear Technology
U2 = Maxim:MAX1551EZK+T: SOT23 Dual-Input USB/AC Adapter 1-Cell Li+ Battery Chargers; MPN: MAX1551EZK+T; OC_FARNELL: 1628221; OC_NEWARK: 59J2760; PACKAGE: SOT-23-5; SUPPLIER: Maxim
U3 = LTC:LT3497EDDBTRMPBF: Dual Full Function White LED Driver with Integrated Schottky Diodes; MPN: LT3497EDDB#TRMPBF; OC_FARNELL: 1715222; OC_NEWARK: 88M1943; PACKAGE: DFN-10; SUPPLIER: Linear Technology
U4 = Custom:CY62167_16MBIT_SRAM
U5 = Custom:S25FL064P
U$1 = lpc177x-lpc178x:LPC177X_8X-208
U$2 = Custom:NHD-3.5-320240MF: Newhaven TFT LCD display NHD-3.5-320240MF 3.5" 320x240 RGB
U$3 = HIROSE-DM3AT:DM3AT
U$4 = Custom:NUP2202: NUP2202 - 5V TVS
X1 = Custom:XTAL_2SMD_8MMX4.5MM: SMD Crystal 2-SMD 8.0 x 4.5 x 1.4mm Crystal Taken from: http://www.abracon.com/Resonators/abm2.pdf; DIGIKEY: 535-10875-1-ND